# Altium project mainboad-kugreen.PrjPcb
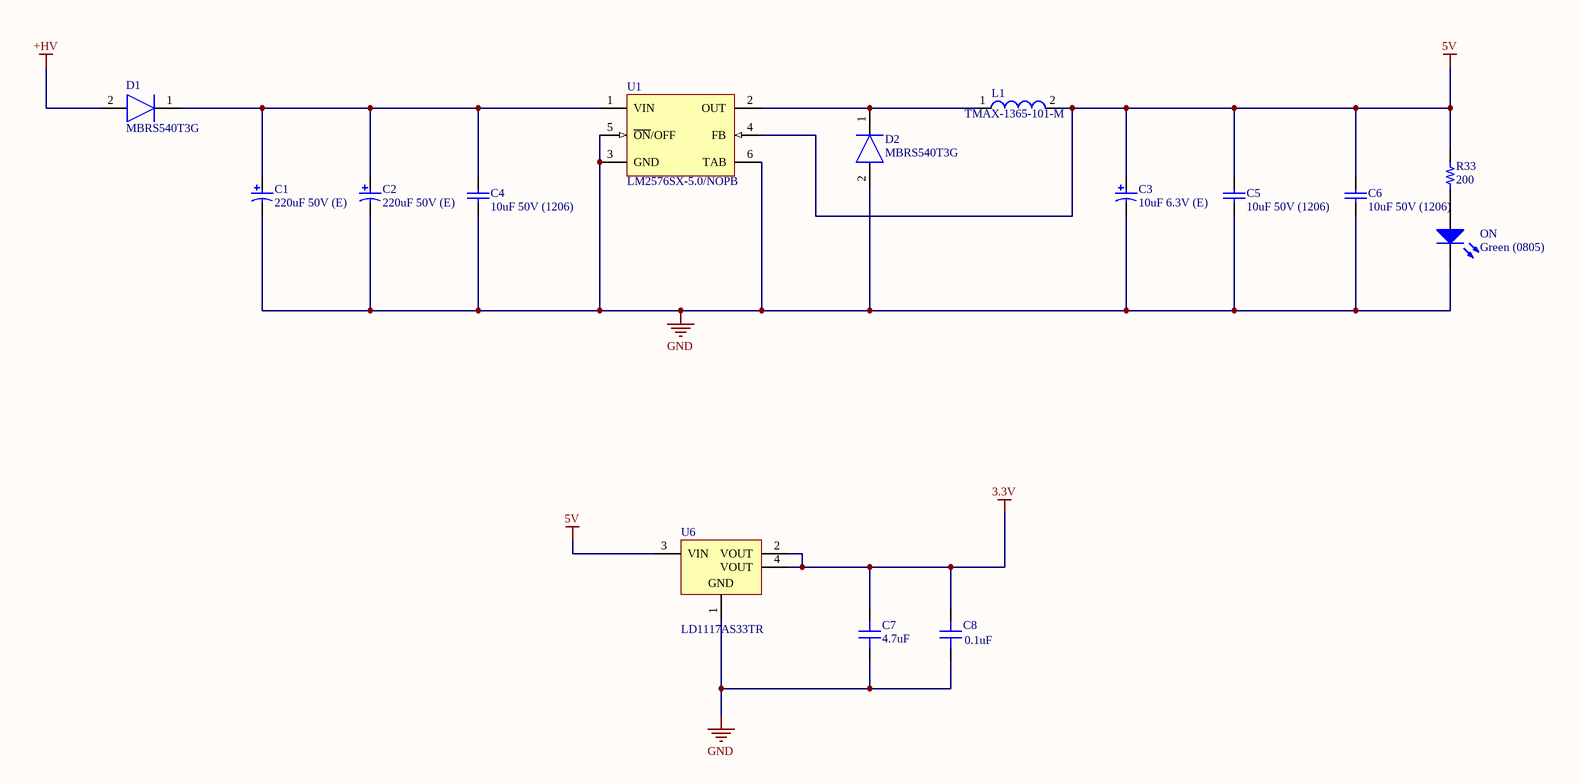
[diagram p0: power-section.SchDoc]
5 sheets, 83 parts. Net scope: global (net labels, ports and power ports of the same name join across sheets).
Board file: mainboard-kugreen.PcbDoc
Sheets:
  power-section.SchDoc
  cpu.SchDoc
  adc-peripheral.SchDoc
  communication.SchDoc
  Controller.SchDoc

## Sheet power-section.SchDoc
size B

### Parts
C1  220uF 50V (E)  [PNSC-EEE-1HA221P_L]
C2  220uF 50V (E)  [PNSC-EEE-1HA221P_L]
C3  10uF 6.3V (E)  [NIC-CAPA2-8X10_V]
C4  10uF 50V (1206)  [CAPC3216X229X50LL20T25]
C5  10uF 50V (1206)  [CAPC3216X229X50LL20T25]
C6  10uF 50V (1206)  [CAPC3216X229X50LL20T25]
C7  4.7uF  [CAP 1206_3216 - 1.8MM]
C8  0.1uF  [CAP 0603_1608]
D1  MBRS540T3G  [DIOM7958X256N]
D2  MBRS540T3G  [DIOM7958X256N]
L1  TMAX-1365-101-M  [WE-HCI-1365]
ON  Green (0805)  [0805_A]
R33  200  [RES 0603_1608]
U1  LM2576SX-5.0/NOPB  [KTT0005B_M]
U6  LD1117AS33TR  [SOT-223_M]

### Nets
3.3V: C7.2 C8.2 U6.2(VOUT) U6.4(VOUT)
5V: C3.1 C5.2 C6.2 L1.2 R33.2 U1.4(FB) U6.3(VIN)
+HV: D1.2(A)
GND: C1.2 C2.2 C3.2 C4.1 C5.1 C6.1 C7.1 C8.1 D2.2(A) ON.1(K) U1.3(GND) U1.5(~{ON}/OFF) U1.6(TAB) U6.1(GND)
NetC1_1: C1.1 C2.1 C4.2 D1.1(K) U1.1(VIN)
NetD2_1: D2.1(K) L1.1 U1.2(OUT)
NetON_2: ON.2(A) R33.1

### Notes on the sheet
- Title
- Size:
- Date:
- B
- Number:
- Time:
- Revision:
- Sheet
- of
- Maptix Co.,Ltd
- 99/193 Atoll Bali Beach
- Khlong Luang Phaeng
- Chacheongsao
- Thailand 24000
- File:

### Library data of the parts
C1 C2 = CMP-2000-06200-1: Aluminum Electrolytic Capacitor, 220 uF, +/- 20%, 50 V, -40 to 85 degC, 2-Pin SMD, RoHS, Tape and Reel; Manufacturer: Panasonic; Lifetime @ Temperature: 2000hours@85°C; AE Capacitor Case: RadialCan-SMD; Capacitance: 220µF; Ripple Current AC: 300mA; SVHC: ToBeAdvised; Product Range: PANASONIC-SSeries; Datasheet Version: 11/2012; Manufacturer URL: http://www.panasonic.com/; Packaging: CutTape; Life Time @ Temperature: 2000hours@85°C; Capacitor Case Style: RadialCan-SMD; Capacitance Tolerance ±: ±20%; Mounting Technology: SurfaceMount; Operating Temperature Max: 85°C; Capacitance Tolerance: ±20%; Package Description: 2-Pin Surface Mount Device, Body 10.3 x 10.3 mm; Voltage Rating: 50V; Package Reference: SMD; Diameter: 10mm; Height: 10.2mm; Operating Temperature Min: -40°C; Datasheet URL: http://datasheet.octopart.com/EEE-1HA221P-Panasonic-datasheet-13265900.pdf
C3 = CMP-0687-00071-1: Aluminum Electrolytic Capacitor, UD Series, Low Impedance, 1000 uF, 6.3 V, + / - 20%, -55 to 105 degC, Chip Type, 8 x 10 mm D x L, Pb-Free, Reel; Manufacturer: Nichicon; PartNumber: UUD0J102MNL1GS; Impedance: 0.17 Ohm; Endurance Time: 5000 h; Rated Capacitance: 1000 uF; Rated Ripple Current (at 100kHz): 450 mA; Packing: Dia382mm Reel; Tolerance Rated Capacitance: -20 to 20%; Diameter: 8 mm; ComponentLink3Description: Package Specification; Mounting Technology: Surface Mount; RoHS: TRUE; ComponentLink3URL: http://products.nichicon.co.jp/en/pdf/XJA043/e-ud.pdf; Length: 10 mm; PackageDescription: 2-Pin Surface Mount Device, Diameter 8 mm, Height 10 mm, Pitch 6.5 mm; DatasheetVersion: 08/2012; ComponentLink2Description: Datasheet; ComponentLink1URL: http://www.nichicon.co.jp/; ComponentLink1Description: Manufacturer URL; Rated Voltage: 6.3 V; ComponentLink2URL: http://products.nichicon.co.jp/en/pdf/XJA043/e-ud.pdf; PackageReference: CAPAE-D8H10
C4-C6 = CMP-2000-05863-1: Chip Capacitor, 10 uF, +/- 10%, 25 V, -55 to 85 degC, 1206 (3216 Metric), RoHS, Tape and Reel; Manufacturer: AVX; Rated Voltage: 25V; Dielectric: X5R; Capacitance: 10µF; Mounting Technology: SurfaceMount; Package Reference: 1206; Tolerance (%): ±10%; Manufacturer URL: http://www.avx.com/; Datasheet URL: http://datasheets.avx.com/cx5r.pdf; Package Description: 2-Pin Surface Mount Device, Body 3.2 x 1.6 mm; Datasheet Version: 05/2016; Case Size/Dimension: 1206
C7 = C1206C335K4PACTU: CAP CERAMIC 16V X5R 1206; Manufacturer: KEMET; Capacitance: 3.3µF; Tolerance: ±10%; Part Number: C1206C335K4PACTU; Value: 4.7uF; Applications: General Purpose; ComponentLink1Description: Datasheet; ComponentLink1URL: https://api.kemet.com/component-edge/download/datasheet/C1206C335K4PACTU.pdf; ComponentLink2Description: DigiKey Link; ComponentLink2URL: http://digikey.com/product-detail/en/kemet/C1206C335K4PACTU/399-1264-1-ND/411539; Device Package: 1206 (3216 Metric); LastUpdated: 1/2/2020 12:03:41 AM; Lifecycle Status: Active; Minimum Order: 1; Mounting Type: Surface Mount, MLCC; Operating Temperature: -55°C ~ 85°C; Package / Case: 1206 (3216 Metric); Packaging: ReReel; PartId: 19546; Part Status: Active; Price: 0.00; Series: SMD Comm X5R; Size / Dimension: 0.126" L x 0.063" W (3.20mm x 1.60mm); Supplier 1: DigiKey; Supplier Part Number 1: 399-1264-1-ND; Temperature Coefficient: X5R; Thickness (Max): 0.071" (1.80mm); Voltage - Rated: 16V
C8 = VJ0603Y332JXACW1BC: CAP CERAMIC 50V X7R 0603; Manufacturer: Vishay Vitramon; Capacitance: 3300pF; Tolerance: ±5%; Part Number: VJ0603Y332JXACW1BC; Value: 0.1uF; Applications: General Purpose; ComponentLink1Description: Datasheet; ComponentLink1URL: https://www.vishay.com/docs/28548/vjw1bcbascomseries.pdf; ComponentLink2Description: DigiKey Link; ComponentLink2URL: http://digikey.com/product-detail/en/vishay-vitramon/VJ0603Y332JXACW1BC/720-VJ0603Y332JXACW1BCCT-ND/11198425; Device Package: 0603 (1608 Metric); LastUpdated: 1/2/2020 12:01:35 AM; Lifecycle Status: Active; Minimum Order: 1; Mounting Type: Surface Mount, MLCC; Operating Temperature: -55°C ~ 125°C; Package / Case: 0603 (1608 Metric); Packaging: Unknown; PartId: 26247; Part Status: Active; Price: 0.00; Series: VJ; Size / Dimension: 0.063" L x 0.031" W (1.60mm x 0.80mm); Supplier 1: DigiKey; Supplier Part Number 1: 720-VJ0603Y332JXACW1BCCT-ND; Temperature Coefficient: X7R; Thickness (Max): 0.034" (0.87mm); Voltage - Rated: 50V
D1 D2 = MBRS540T3G: Diode; Manufacturer_Name: ON Semiconductor; Allied_Number: 70100196; Datasheet Link: http://www.onsemi.com/pub/Collateral/MBRS540T3-D.PDF; Height: 2.56mm; Manufacturer_Part_Number: MBRS540T3G; Mouser Part Number: 863-MBRS540T3G; Mouser Price/Stock: https://www.mouser.com/Search/Refine.aspx?Keyword=863-MBRS540T3G; RS Part Number: 6880512; RS Price/Stock: https://uk.rs-online.com/web/p/products/6880512; Allied Price/Stock: http://www.alliedelec.com/on-semiconductor-mbrs540t3g/70100196/
L1 = CMP-1351-00012-1: SMD Flat Wire High Current Inductor WE-HCI, L=33.0 µH; Manufacturer: Wuerth Elektronik; PartNumber: 7443551331; Inductance: 33.0 ÂµH; ComponentLink1Description: Manufacturer URL; ComponentLink1URL: http://www.we-online.com; PackageDescription: Inductor, 2-Leads, Body 13.2 x 12.8 mm; ComponentLink2URL: http://katalog.we-online.de/kataloge/eisos/media/pdf/7443551331.pdf; ComponentLink2Description: Datasheet; PackageReference: WE-HCI-1365
ON = CMP-1426-00007-1: SMD mono-color Chip LED, WL-SMCW, Green; PartNumber: 150080GS75000; Manufacturer: Wuerth Elektronik; PackageReference: 0805_A; Color: Green; ComponentLink2URL: http://katalog.we-online.com/led/datasheet/150080GS75000.pdf; ComponentLink1URL: http://www.we-online.com; ComponentLink1Description: Manufacturer URL; ComponentLink2Description: Datasheet
R33 = CRCW060329K4FKEA: Resistor; Manufacturer: Vishay Dale; Power (Watts): 0.1W, 1/10W; Resistance: 29.4 kOhms; Temperature Coefficient: ±100ppm/°C; Tolerance: ±1%; Part Number: CRCW060329K4FKEA; Value: 200; ComponentLink1Description: Datasheet; ComponentLink1URL: http://www.vishay.com/docs/20035/dcrcwe3.pdf; ComponentLink2Description: DigiKey Link; ComponentLink2URL: http://digikey.com/product-detail/en/vishay-dale/CRCW060329K4FKEA/541-29.4KHCT-ND/1179975; Composition: Thick Film; Device Package: 0603 (1608 Metric); Features: Automotive AEC-Q200; Height - Seated (Max): 0.020" (0.50mm); LastUpdated: 1/2/2020 12:06:58 AM; Lifecycle Status: Active; Minimum Order: 1; Number of Terminations: 2; Operating Temperature: -55°C ~ 155°C; Package / Case: 0603 (1608 Metric); Packaging: TapeAndReel; PartId: 7975; Part Status: Active; Price: 0.00; Ratings: AEC-Q200; Series: CRCW; Size / Dimension: 0.061" L x 0.033" W (1.55mm x 0.85mm); Supplier 1: DigiKey; Supplier Part Number 1: 541-29.4KHCT-ND; Supplier Device Package: 0603
U1 = CMP-0069-00122-3: SIMPLE SWITCHER® 3A Step-Down Voltage Regulator, 5-pin TO-263, Pb-Free; Manufacturer: Texas Instruments; PackageTopMarking: NSUZXYTTE#*LM2576S*-5.0 P+; PowerWise: N; PackageDescription: TO-263, Molded, .400 x .390 x .180in, 5 Lead, .067in Pitch, Surface Mount; PinCount: 5; PackageReference: KTT0005B; ComponentLink1Description: Datasheet URL; ComponentLink1URL: http://www.ti.com/general/docs/lit/getliterature.tsp?genericPartNumber=LM2576&fileType=pdf; Code_JEDEC: MO-169-AB; CompType: Switcher; RoHS: Y
U6 = CMP-0244-00316-1: 1A, Low Drop Positive Voltage Regulator, 3.3V, 4-Pin SOT-223, Tape and Reel; ComponentLink1Description: Manufacturer URL; DatasheetVersion: 2/12/2011; PackageVersion: 2010; ComponentLink1URL: http://www.st.com; ComponentLink2Description: Datasheet; ComponentLink2URL: http://www.st.com/internet/com/TECHNICAL_RESOURCES/TECHNICAL_LITERATURE/DATASHEET/CD00002116.pdf; PackageDescription: 4-Pin SOT-223 Package, 6.5 x 3.5 mm Body, 2.3 mm Pitch, 7 mm Lead Span; PackageReference: SOT-223

## Sheet cpu.SchDoc
size B
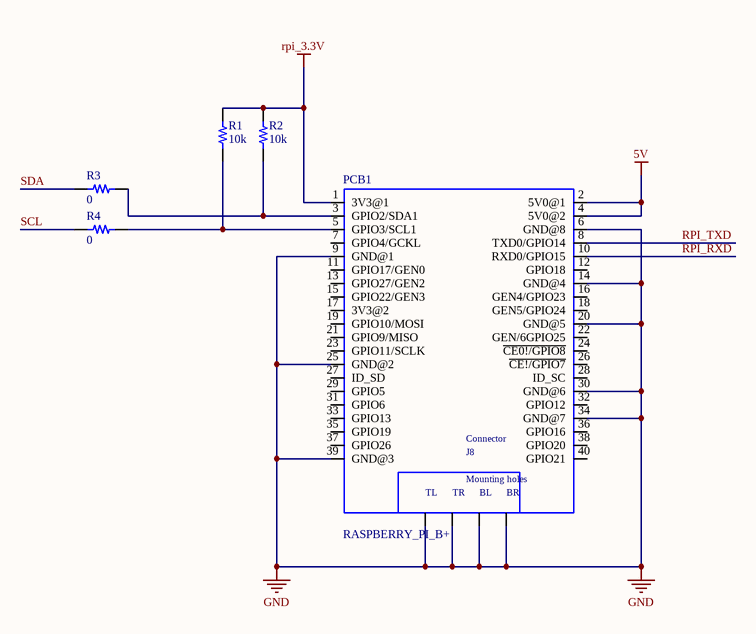
[diagram p1: cpu.SchDoc]

### Parts
PCB1  RASPBERRY_PI_B+  [RASPBERRY_PI_B+]
R1  10k  [RES 0603_1608]
R2  10k  [RES 0603_1608]
R3  0  [RES 0603_1608]
R4  0  [RES 0603_1608]

### Nets
5V: PCB1.2(5V0@1) PCB1.4(5V0@2)
GND: PCB1.6(GND@8) PCB1.9(GND@1) PCB1.14(GND@4) PCB1.20(GND@5) PCB1.25(GND@2) PCB1.30(GND@6) PCB1.34(GND@7) PCB1.39(GND@3) PCB1.PE_BL(BL) PCB1.PE_BR(BR) PCB1.PE_TL(TL) PCB1.PE_TR(TR)
rpi_3.3V: PCB1.1(3V3@1) R1.1 R2.1
RPI_RXD: PCB1.10(RXD0/GPIO15)
RPI_TXD: PCB1.8(TXD0/GPIO14)
SCL: R4.1
SDA: R3.1
NetPCB1_3: PCB1.3(GPIO2/SDA1) R2.2 R3.2
NetPCB1_5: PCB1.5(GPIO3/SCL1) R1.2 R4.2

Not connected (* = marked no-connect by the designer): PCB1 7(GPIO4/GCKL) 11(GPIO17/GEN0) 12(GPIO18) 13(GPIO27/GEN2) 15(GPIO22/GEN3) 16(GEN4/GPIO23) 17(3V3@2) 18(GEN5/GPIO24) 19(GPIO10/MOSI) 21(GPIO9/MISO) 22(GEN/6GPIO25) 23(GPIO11/SCLK) 24(~{CE0!/GPIO8}) 26(~{CE!/GPIO7}) 27(ID_SD) 28(ID_SC) 29(GPIO5) 31(GPIO6) 32(GPIO12) 33(GPIO13) 35(GPIO19) 36(GPIO16) 37(GPIO26) 38(GPIO20) 40(GPIO21)

### Notes on the sheet
- Title
- Size:
- Date:
- B
- Number:
- Time:
- Revision:
- Sheet
- of
- Maptix Co.,Ltd
- 99/193 Atoll Bali Beach
- Khlong Luang Phaeng
- Chacheongsao
- Thailand 24000
- File:
- (in symbol RASPBERRY_PI_B+) Connector; J8; Mounting holes

### Library data of the parts
PCB1 = RASPBERRY_PI_B+: BCM2835 Raspberry Pi Model B+ - ARM11, VideoCore MPU Embedded Evaluation Board; MP: RASPBERRY PI B+; Package: None; Availability: Unavailable; Value: *; SnapEDA_Link: https://www.snapeda.com/parts/RASPBERRY%20PI%20B%2B/Raspberry%20Pi/view-part/559759/?ref=snap; Price: None; MF: Raspberry Pi
R1-R4 = CRCW060329K4FKEA: as R33 on sheet power-section; Part Number: CRCW060329K4FKEA; ComponentLink1Description: Datasheet; ComponentLink1URL: http://www.vishay.com/docs/20035/dcrcwe3.pdf; ComponentLink2Description: DigiKey Link; ComponentLink2URL: http://digikey.com/product-detail/en/vishay-dale/CRCW060329K4FKEA/541-29.4KHCT-ND/1179975; Composition: Thick Film; Device Package: 0603 (1608 Metric); Features: Automotive AEC-Q200; Height - Seated (Max): 0.020" (0.50mm); LastUpdated: 1/2/2020 12:06:58 AM; Lifecycle Status: Active; Minimum Order: 1; Number of Terminations: 2; Operating Temperature: -55°C ~ 155°C; Package / Case: 0603 (1608 Metric); Packaging: TapeAndReel; PartId: 7975; Part Status: Active; Price: 0.00; Ratings: AEC-Q200; Series: CRCW; Size / Dimension: 0.061" L x 0.033" W (1.55mm x 0.85mm); Supplier 1: DigiKey; Supplier Part Number 1: 541-29.4KHCT-ND; Supplier Device Package: 0603
  R1 R2: Value: 10k
  R3 R4: Value: 0

## Sheet adc-peripheral.SchDoc
size B
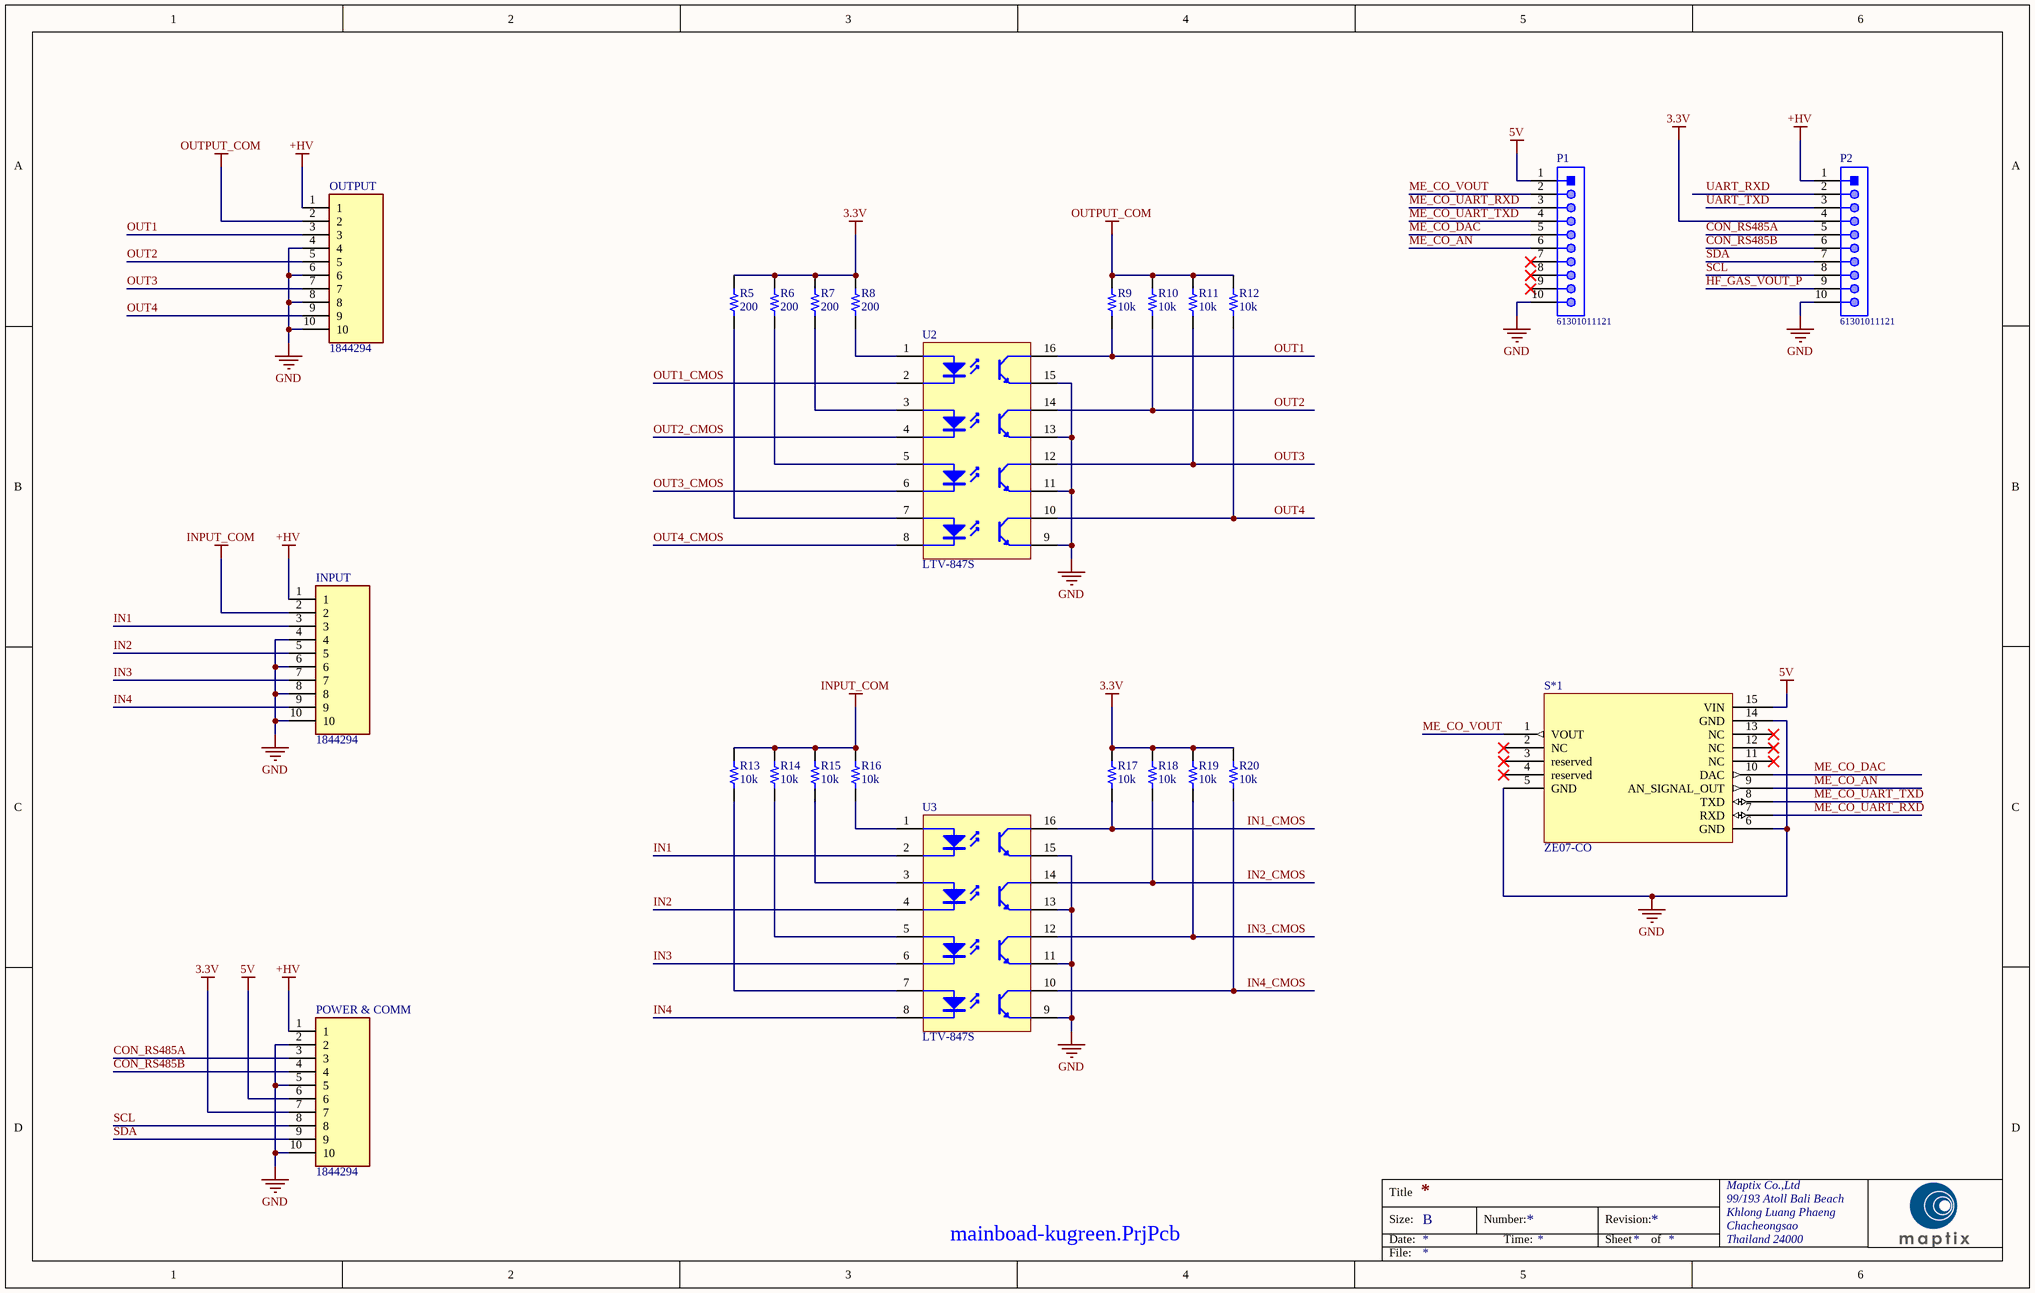
[diagram p2: adc-peripheral.SchDoc]

### Parts
INPUT  1844294  [SHDR10W100P0X350_1X10_3640X920X725P]
OUTPUT  1844294  [SHDR10W100P0X350_1X10_3640X920X725P]
P1  61301011121  [61301011121]
P2  61301011121  [61301011121]
POWER_&_COMM  1844294  [SHDR10W100P0X350_1X10_3640X920X725P]
R5  200  [RES 0603_1608]
R6  200  [RES 0603_1608]
R7  200  [RES 0603_1608]
R8  200  [RES 0603_1608]
R9  10k  [RES 0603_1608]
R10  10k  [RES 0603_1608]
R11  10k  [RES 0603_1608]
R12  10k  [RES 0603_1608]
R13  10k  [RES 0603_1608]
R14  10k  [RES 0603_1608]
R15  10k  [RES 0603_1608]
R16  10k  [RES 0603_1608]
R17  10k  [RES 0603_1608]
R18  10k  [RES 0603_1608]
R19  10k  [RES 0603_1608]
R20  10k  [RES 0603_1608]
S*1  ZE07-CO  [ZE07-CO]
U2  LTV-847S  [LTST-LTV-847S_V]
U3  LTV-847S  [LTST-LTV-847S_V]

### Nets
3.3V: P2.4 POWER_&_COMM.7 R5.2 R6.2 R7.2 R8.2 R17.2 R18.2 R19.2 R20.2
5V: P1.1 POWER_&_COMM.6 S*1.15(VIN)
+HV: INPUT.1 OUTPUT.1 P2.1 POWER_&_COMM.1
GND: INPUT.4 INPUT.6 INPUT.8 INPUT.10 OUTPUT.4 OUTPUT.6 OUTPUT.8 OUTPUT.10 P1.10 P2.10 POWER_&_COMM.2 POWER_&_COMM.5 POWER_&_COMM.10 S*1.5(GND) S*1.6(GND) S*1.14(GND) U2.9(Emitter4) U2.11(Emitter3) U2.13(Emitter2) U2.15(Emitter1) U3.9(Emitter4) U3.11(Emitter3) U3.13(Emitter2) U3.15(Emitter1)
INPUT_COM: INPUT.2 R13.2 R14.2 R15.2 R16.2
OUTPUT_COM: OUTPUT.2 R9.2 R10.2 R11.2 R12.2
CON_RS485A: P2.5 POWER_&_COMM.3
CON_RS485B: P2.6 POWER_&_COMM.4
HF_GAS_VOUT_P: P2.9
IN1: INPUT.3 U3.2(Cathode1)
IN1_CMOS: R17.1 U3.16(Collector1)
IN2: INPUT.5 U3.4(Cathode2)
IN2_CMOS: R18.1 U3.14(Collector2)
IN3: INPUT.7 U3.6(Cathode3)
IN3_CMOS: R19.1 U3.12(Collector3)
IN4: INPUT.9 U3.8(Cathode4)
IN4_CMOS: R20.1 U3.10(Collector4)
ME_CO_AN: P1.6 S*1.9(AN_SIGNAL_OUT)
ME_CO_DAC: P1.5 S*1.10(DAC)
ME_CO_UART_RXD: P1.3 S*1.7(RXD)
ME_CO_UART_TXD: P1.4 S*1.8(TXD)
ME_CO_VOUT: P1.2 S*1.1(VOUT)
OUT1: OUTPUT.3 R9.1 U2.16(Collector1)
OUT1_CMOS: U2.2(Cathode1)
OUT2: OUTPUT.5 R10.1 U2.14(Collector2)
OUT2_CMOS: U2.4(Cathode2)
OUT3: OUTPUT.7 R11.1 U2.12(Collector3)
OUT3_CMOS: U2.6(Cathode3)
OUT4: OUTPUT.9 R12.1 U2.10(Collector4)
OUT4_CMOS: U2.8(Cathode4)
SCL: P2.8 POWER_&_COMM.8
SDA: P2.7 POWER_&_COMM.9
UART_RXD: P2.2
UART_TXD: P2.3
NetR5_1: R5.1 U2.7(Anode4)
NetR6_1: R6.1 U2.5(Anode3)
NetR7_1: R7.1 U2.3(Anode2)
NetR8_1: R8.1 U2.1(Anode1)
NetR13_1: R13.1 U3.7(Anode4)
NetR14_1: R14.1 U3.5(Anode3)
NetR15_1: R15.1 U3.3(Anode2)
NetR16_1: R16.1 U3.1(Anode1)

Not connected (* = marked no-connect by the designer): P1 7* 8* 9*; S*1 2(NC)* 3(reserved)* 4(reserved)* 11(NC)* 12(NC)* 13(NC)*

### Notes on the sheet
- Title
- Size:
- Date:
- B
- Number:
- Time:
- Revision:
- Sheet
- of
- Maptix Co.,Ltd
- 99/193 Atoll Bali Beach
- Khlong Luang Phaeng
- Chacheongsao
- Thailand 24000
- File:

### Library data of the parts
INPUT OUTPUT POWER_&_COMM = 1844294: Connector; Manufacturer_Name: Phoenix Contact; Allied_Number: 70054526; Datasheet Link: http://docs-emea.rs-online.com/webdocs/12bb/0900766b812bb07b.pdf; Height: 7.25mm; Manufacturer_Part_Number: 1844294; Mouser Part Number: 651-1844294; Mouser Price/Stock: https://www.mouser.com/Search/Refine.aspx?Keyword=651-1844294; RS Part Number: 8042267; RS Price/Stock: http://uk.rs-online.com/web/p/products/8042267; Allied Price/Stock: http://www.alliedelec.com/phoenix-contact-1844294/70054526/
P1 P2 = CMP-1502-01082-1: THT Vertical Pin Header WR-PHD, Pitch 2.54 mm, Single Row, 10 pins; Manufacturer: Wurth Elektronik; Contact Resistance: 20mOhm; Rated Current: 3A; Pitch: 2.54mm; Gender: Male; Pin Number: 10; Working Voltage: 250VAC; Withstanding Voltage: 500VAC; Manufacturer URL: http://www.we-online.de; Operating Temperature: -40to105degC; Datasheet URL: https://katalog.we-online.de/em/datasheet/6130xx11121.pdf; Row Number: Single; Orientation: Vertical; Part Number: 61301011121; Packaging: Bag; Package Reference: 61301011121; Mounting Technology: THT; Publisher: WurthElektronik
R5-R20 = CRCW060329K4FKEA: as R33 on sheet power-section; Part Number: CRCW060329K4FKEA; ComponentLink1Description: Datasheet; ComponentLink1URL: http://www.vishay.com/docs/20035/dcrcwe3.pdf; ComponentLink2Description: DigiKey Link; ComponentLink2URL: http://digikey.com/product-detail/en/vishay-dale/CRCW060329K4FKEA/541-29.4KHCT-ND/1179975; Composition: Thick Film; Device Package: 0603 (1608 Metric); Features: Automotive AEC-Q200; Height - Seated (Max): 0.020" (0.50mm); LastUpdated: 1/2/2020 12:06:58 AM; Lifecycle Status: Active; Minimum Order: 1; Number of Terminations: 2; Operating Temperature: -55°C ~ 155°C; Package / Case: 0603 (1608 Metric); Packaging: TapeAndReel; PartId: 7975; Part Status: Active; Price: 0.00; Ratings: AEC-Q200; Series: CRCW; Size / Dimension: 0.061" L x 0.033" W (1.55mm x 0.85mm); Supplier 1: DigiKey; Supplier Part Number 1: 541-29.4KHCT-ND; Supplier Device Package: 0603
  R5-R8: Value: 200
  R9-R20: Value: 10k
U2 U3 = CMP-2000-06633-1: Photocoupler, 50 mA, -30 to 110 degC, 16-Pin SMD, RoHS, Tube; Manufacturer: Lite-On; Output Voltage-Max: 35V; CTR-Min: 50%; No of Channels: 4; Isolation Voltage-Max: 5000V; Package Reference: LTV-847S; Operating Temp-Max: 100°C; Datasheet Version: Rev. K, 03/2010; Datasheet URL: http://optoelectronics.liteon.com/upload/download/DS-70-96-0016/S_110_LTV-817%20%20827%20%20847%20(%20M,%20S,%20S-TA,%20S-TA1,%20S-TP%20)%20Series.pdf; Manufacturer URL: http://www.us.liteon.com/; Package Description: 16-Pin Surface Mount Device, Body 19.84 x 6.5 mm, Pitch 2.54 mm; Mounting Technology: SurfaceMount

## Sheet communication.SchDoc: Communication-interface
size B
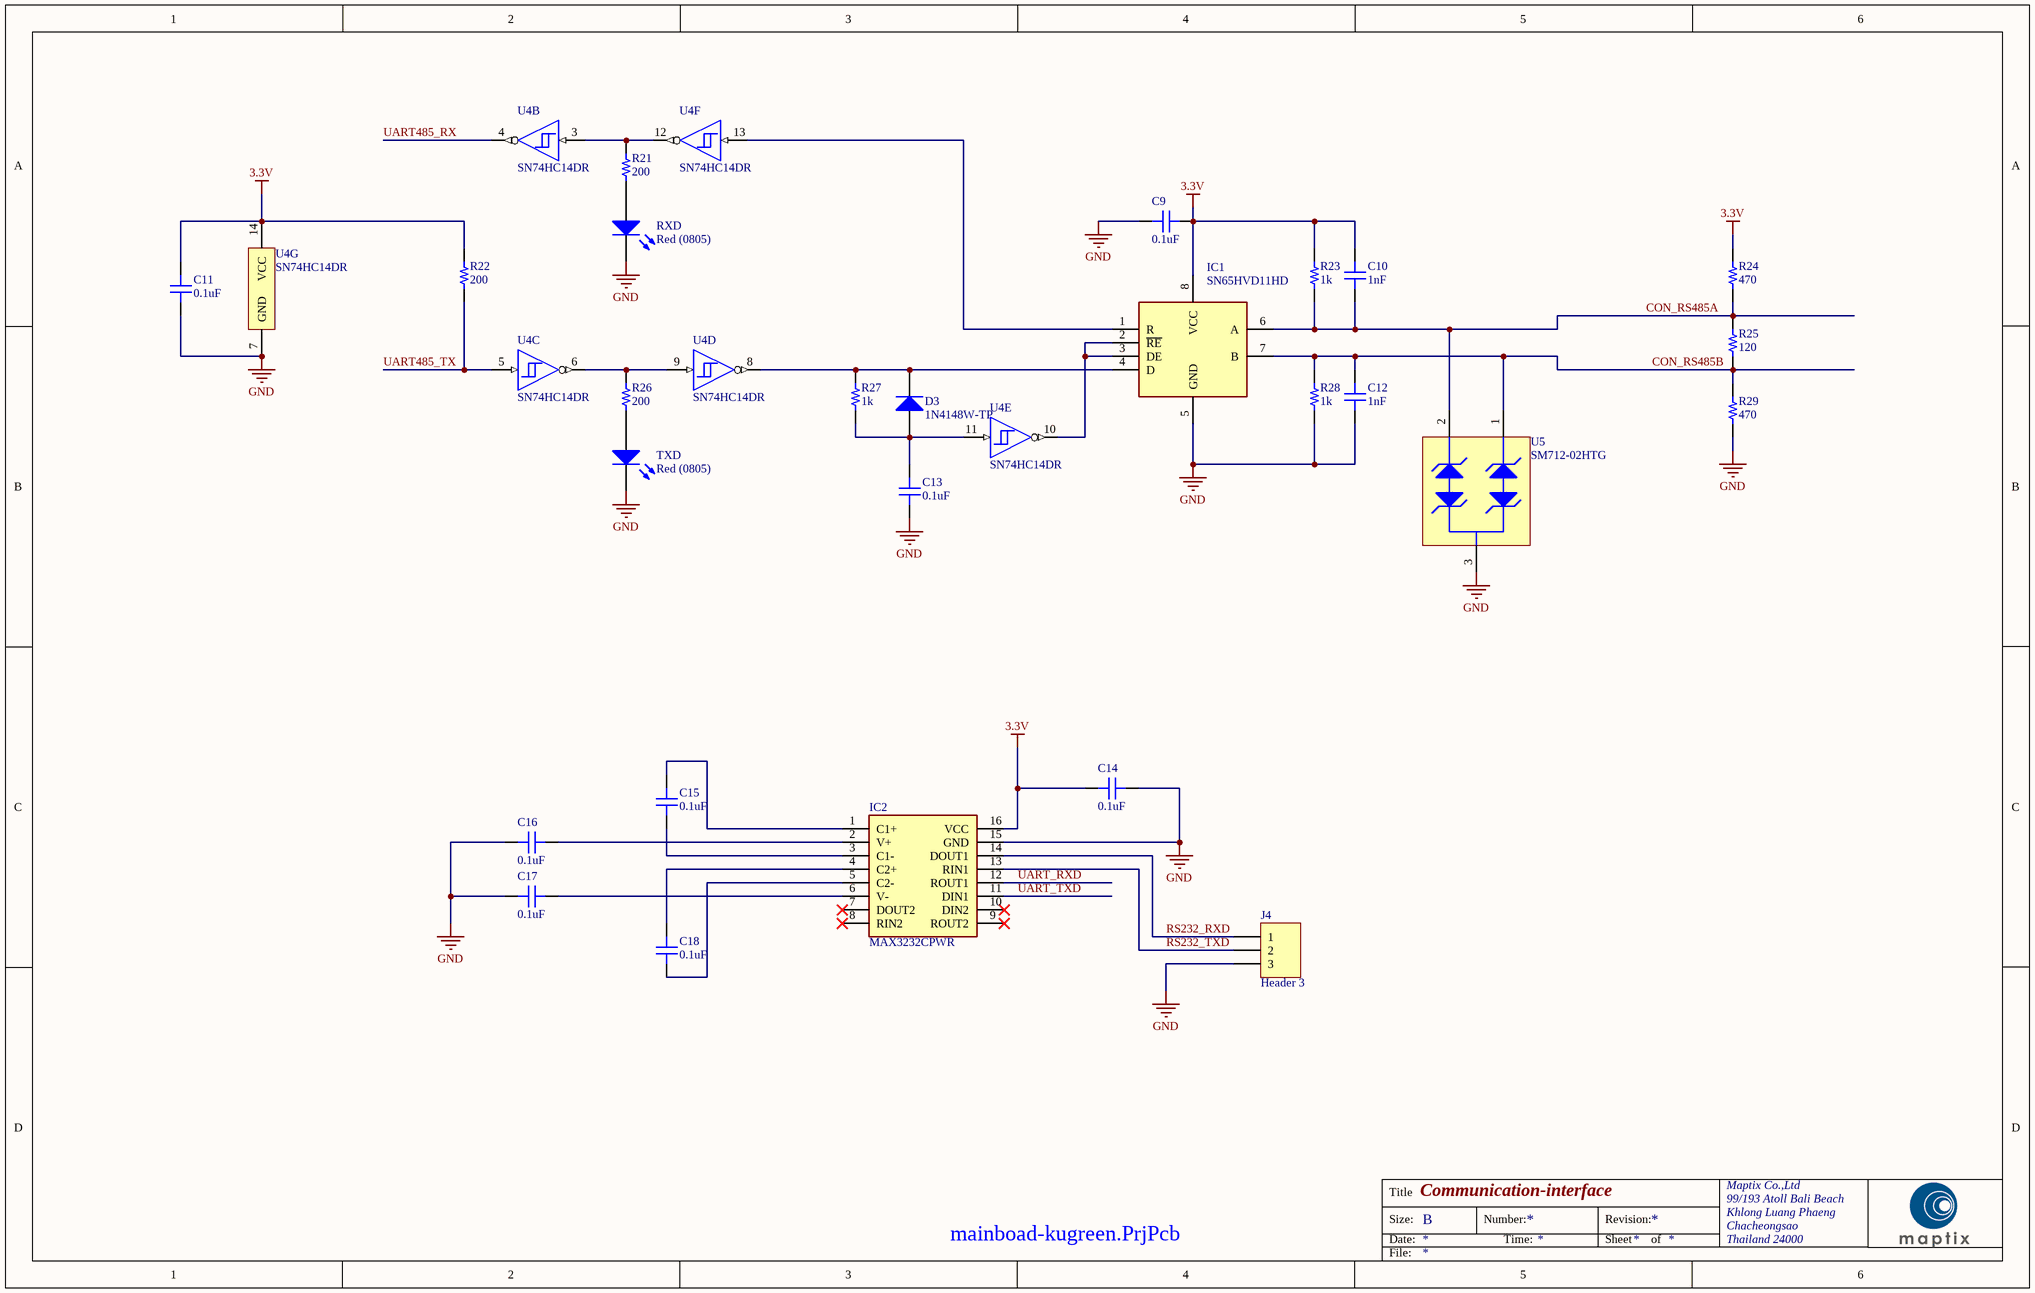
[diagram p3: communication.SchDoc]

### Parts
C9  0.1uF  [CAP 0603_1608]
C10  1nF  [CAP 0603_1608]
C11  0.1uF  [CAP 0603_1608]
C12  1nF  [CAP 0603_1608]
C13  0.1uF  [CAP 0603_1608]
C14  0.1uF  [CAP 0603_1608]
C15  0.1uF  [CAP 0603_1608]
C16  0.1uF  [CAP 0603_1608]
C17  0.1uF  [CAP 0603_1608]
C18  0.1uF  [CAP 0603_1608]
D3  1N4148W-TP  [MCC-SOD123_V]
IC1  SN65HVD11HD  [SOIC127P600X175-8N]
IC2  MAX3232CPWR  [SOP65P640X120-16N]
J4  Header 3  [HDR1X3]
R21  200  [RES 0603_1608]
R22  200  [RES 0603_1608]
R23  1k  [RES 0603_1608]
R24  470  [RES 0603_1608]
R25  120  [RES 0603_1608]
R26  200  [RES 0603_1608]
R27  1k  [RES 0603_1608]
R28  1k  [RES 0603_1608]
R29  470  [RES 0603_1608]
RXD  Red (0805)  [0805_A]
TXD  Red (0805)  [0805_A]
U4  SN74HC14DR  [D0014A_N]  (parts B,C,D,E,F,G of 7)
U5  SM712-02HTG  [LFUS-SOT23-3_V]

### Nets
3.3V: C9.2 C10.2 C11.2 C14.1 IC1.8(VCC) IC2.16(VCC) R22.2 R23.2 R24.2 U4.14(VCC)
GND: C9.1 C11.1 C12.1 C13.1 C14.2 C16.1 C17.1 IC1.5(GND) IC2.15(GND) J4.3 R28.1 R29.1 RXD.1(K) TXD.1(K) U4.7(GND) U5.3
CON_RS485A: C10.1 IC1.6(A) R23.1 R24.1 R25.2 U5.2
CON_RS485B: C12.2 IC1.7(B) R25.1 R28.2 R29.2 U5.1
RS232_RXD: IC2.14(DOUT1) J4.1
RS232_TXD: IC2.13(RIN1) J4.2
UART485_RX: U4.4(~{2Y})
UART485_TX: R22.1 U4.5(3A)
UART_RXD: IC2.12(ROUT1)
UART_TXD: IC2.11(DIN1)
NetC13_2: C13.2 D3.1(A) R27.1 U4.11(5A)
NetC15_1: C15.1 IC2.1(C1+)
NetC15_2: C15.2 IC2.3(C1-)
NetC16_2: C16.2 IC2.2(V+)
NetC17_2: C17.2 IC2.6(V-)
NetC18_1: C18.1 IC2.4(C2+)
NetC18_2: C18.2 IC2.5(C2-)
NetD3_2: D3.2(K) IC1.4(D) R27.2 U4.8(~{4Y})
NetIC1_1: IC1.1(R) U4.13(6A)
NetIC1_2: IC1.2(~{RE}) IC1.3(DE) U4.10(~{5Y})
NetR21_1: R21.1 RXD.2(A)
NetR21_2: R21.2 U4.3(2A) U4.12(~{6Y})
NetR26_1: R26.1 TXD.2(A)
NetR26_2: R26.2 U4.6(~{3Y}) U4.9(4A)

Not connected (* = marked no-connect by the designer): IC2 7(DOUT2)* 8(RIN2)* 9(ROUT2)* 10(DIN2)*

### Notes on the sheet
- Title
- Size:
- Date:
- B
- Number:
- Time:
- Revision:
- Sheet
- of
- Maptix Co.,Ltd
- 99/193 Atoll Bali Beach
- Khlong Luang Phaeng
- Chacheongsao
- Thailand 24000
- File:

### Library data of the parts
C9-C18 = VJ0603Y332JXACW1BC: as C8 on sheet power-section; Part Number: VJ0603Y332JXACW1BC; Applications: General Purpose; ComponentLink1Description: Datasheet; ComponentLink1URL: https://www.vishay.com/docs/28548/vjw1bcbascomseries.pdf; ComponentLink2Description: DigiKey Link; ComponentLink2URL: http://digikey.com/product-detail/en/vishay-vitramon/VJ0603Y332JXACW1BC/720-VJ0603Y332JXACW1BCCT-ND/11198425; Device Package: 0603 (1608 Metric); LastUpdated: 1/2/2020 12:01:35 AM; Lifecycle Status: Active; Minimum Order: 1; Mounting Type: Surface Mount, MLCC; Operating Temperature: -55°C ~ 125°C; Package / Case: 0603 (1608 Metric); Packaging: Unknown; PartId: 26247; Part Status: Active; Price: 0.00; Series: VJ; Size / Dimension: 0.063" L x 0.031" W (1.60mm x 0.80mm); Supplier 1: DigiKey; Supplier Part Number 1: 720-VJ0603Y332JXACW1BCCT-ND; Temperature Coefficient: X7R; Thickness (Max): 0.034" (0.87mm); Voltage - Rated: 50V
  C9 C11 C13-C18: Value: 0.1uF
  C10 C12: Value: 1nF
D3 = CMP-2000-04993-1: High Speed Switching Diode, 400 mW, 150 mA, -65 to 150 degC, 2-Pin SOD123, RoHS, Tape and Reel; Manufacturer: Micro Commercial Components; Reverse Recovery Time-Max: 4ns; Average Forward Current-Max: 0.15A; Peak Current-Max: 2A; Power Dissipation: 400mW; Reverse Voltage-Max [Vrrm]: 100V; Datasheet URL: https://datasheet.ciiva.com/16836/1n4148wsod123-16836277.pdf; Package Reference: SOD123; Package URL: http://www.mccsemi.com/up_pdf/1N4448W(SOD-123).pdf; Package Description: 2-Pin Small Outline Diode, Body 2.7 x 1.6 mm, Height 1.35 mm; Manufacturer URL: http://www.mccsemi.com/; Datasheet Version: Rev. C, 07/2014
IC1 = SN65HVD11HD: Integrated Circuit; Manufacturer_Name: Texas Instruments; Datasheet Link: http://www.ti.com/lit/gpn/sn65hvd11-ht; Height: 1.75mm; Manufacturer_Part_Number: SN65HVD11HD; Mouser Part Number: 595-SN65HVD11HD; Mouser Price/Stock: https://www.mouser.com/Search/Refine.aspx?Keyword=595-SN65HVD11HD
IC2 = MAX3232CPWR: Integrated Circuit; Manufacturer_Name: Texas Instruments; Datasheet Link: http://www.ti.com/lit/gpn/max3232; Height: 1.2mm; Manufacturer_Part_Number: MAX3232CPWR; Mouser Part Number: 595-MAX3232CPWR; Mouser Price/Stock: https://www.mouser.com/Search/Refine.aspx?Keyword=595-MAX3232CPWR
J4 = Header 3: Header, 3-Pin; LatestRevisionDate: 17-Jul-2002; LatestRevisionNote: Re-released for DXP Platform.; Publisher: Altium Limited
R21-R29 = CRCW060329K4FKEA: as R33 on sheet power-section; Part Number: CRCW060329K4FKEA; ComponentLink1Description: Datasheet; ComponentLink1URL: http://www.vishay.com/docs/20035/dcrcwe3.pdf; ComponentLink2Description: DigiKey Link; ComponentLink2URL: http://digikey.com/product-detail/en/vishay-dale/CRCW060329K4FKEA/541-29.4KHCT-ND/1179975; Composition: Thick Film; Device Package: 0603 (1608 Metric); Features: Automotive AEC-Q200; Height - Seated (Max): 0.020" (0.50mm); LastUpdated: 1/2/2020 12:06:58 AM; Lifecycle Status: Active; Minimum Order: 1; Number of Terminations: 2; Operating Temperature: -55°C ~ 155°C; Package / Case: 0603 (1608 Metric); Packaging: TapeAndReel; PartId: 7975; Part Status: Active; Price: 0.00; Ratings: AEC-Q200; Series: CRCW; Size / Dimension: 0.061" L x 0.033" W (1.55mm x 0.85mm); Supplier 1: DigiKey; Supplier Part Number 1: 541-29.4KHCT-ND; Supplier Device Package: 0603
  R21 R22 R26: Value: 200
  R23 R27 R28: Value: 1k
  R24 R29: Value: 470
  R25: Value: 120
RXD TXD = CMP-1426-00007-1: as ON on sheet power-section; PackageReference: 0805_A; Color: Green; ComponentLink2URL: http://katalog.we-online.com/led/datasheet/150080GS75000.pdf; ComponentLink1URL: http://www.we-online.com; ComponentLink1Description: Manufacturer URL; ComponentLink2Description: Datasheet
U4 = CMP-1615-00273-3: Hex Schmitt-Trigger Inverters, D0014A, LARGE T&R; Manufacturer: Texas Instruments; tpd @ Nom Voltage(Max)(ns): 31; Schmitt Trigger: Yes; Output Drive (IOL/IOH)(Max)(mA): -4/4; F @ Nom Voltage(Max)(Mhz): 20; Technology Family: HC; Output Type: CMOS; VCC(Min)(V): 2; ICC @ Nom Voltage(Max)(mA): 0.02; Bits(#): 6; Rating: Catalog; Voltage(Nom)(V): 5; PackageReference: D0014A; Code_JEDEC: MS-012; Input Type: CMOS; Operating Temperature Range(C): -40 to 85; Generic Part Number: SN74HC14; VCC(Max)(V): 6; DatasheetVersion: SCLS085G
U5 = CMP-2000-07561-1: TVS Diode Array, 600 W, 12 V, -40 to 125 degC, 3-Pin SOT23, RoHS, Tape and Reel; Manufacturer: Littelfuse; Case\/Package: TO-236-3; Number of Bidirectional Channels: 2; Min Breakdown Voltage: 13.3V; Clamping Voltage: 31V; Direction: Bidirectional; Element Configuration: Dual; Reverse Standoff Voltage: 12V; Max Surge Current: 19A; Leakage Current: 20uA; Capacitance: 75pF; Max Power Dissipation: 600W; Power Line Protection: No; Depth: 1.4mm; Packaging: TapeandReel; Datasheet URL: http://www.littelfuse.com/~/media/electronics/datasheets/tvs_diode_arrays/littelfuse_tvs_diode_array_sm712_datasheet.pdf.pdf; Package Description: 3-Pin Surface Mount Device, Body 2.92 x 1.3 mm, Pitch 0.95 mm; Package Reference: SOT23-3; Lead Free: LeadFree; Datasheet Version: 12/2016; Termination: SMD/SMT; Mounting Technology: SurfaceMount; Package Quantity: 3000; Radiation Hardening: No; Min Operating Temperature: -40degC; Breakdown Voltage: 13.3V; Working Voltage: 12V; RoHSCompliant: True; Number of Channels: 2; Number of Pins: 3; Max Operating Temperature: 125degC; Manufacturer URL: http://www.littelfuse.com/; Polarity: Bidirectional; Mount: SurfaceMount; Peak Pulse Current: 19A; Peak Pulse Power: 600W; Length: 3.04mm

## Sheet Controller.SchDoc: Controller-Section
size B
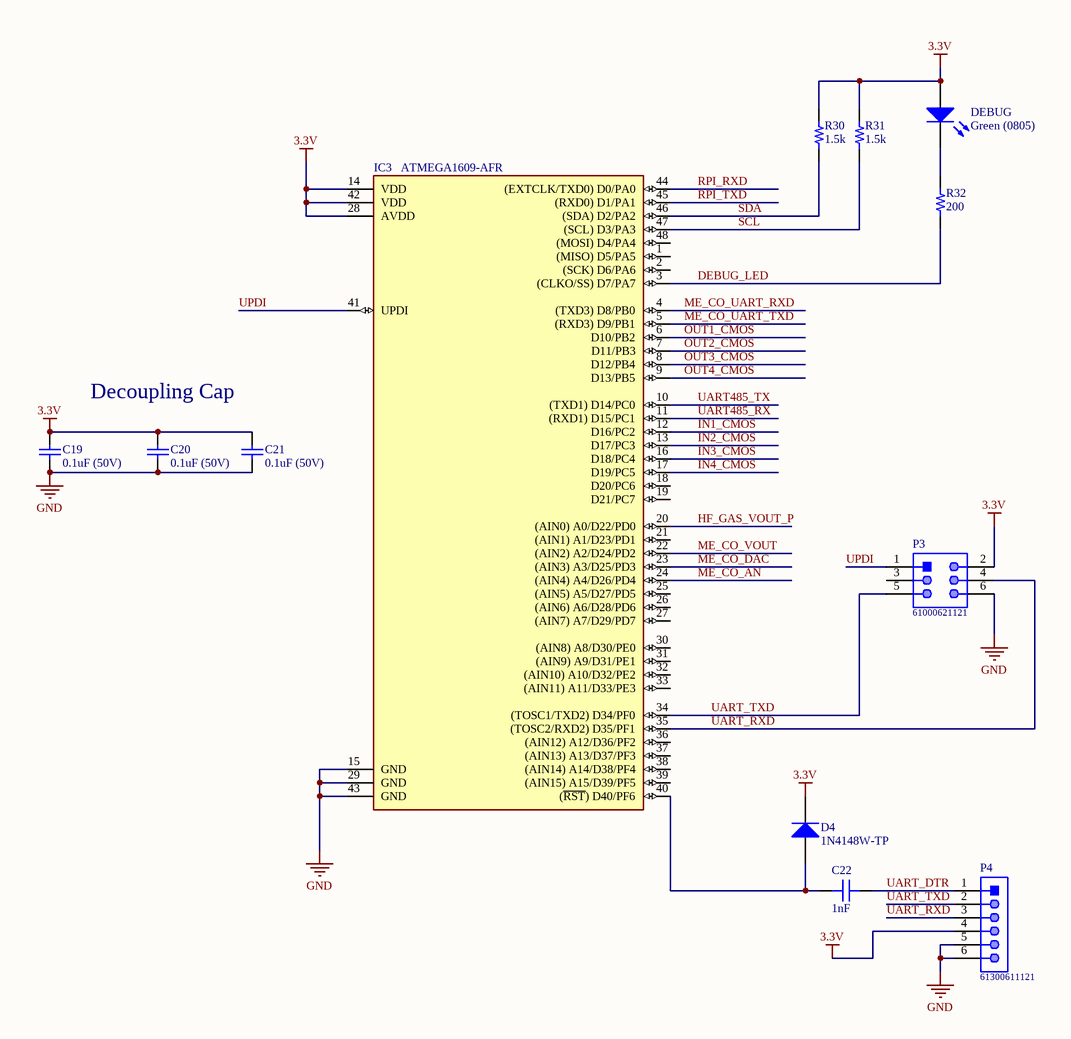
[diagram p4: Controller.SchDoc]

### Parts
C19  0.1uF (50V)  [CAPC1608X95X40NL15T15]
C20  0.1uF (50V)  [CAPC1608X95X40NL15T15]
C21  0.1uF (50V)  [CAPC1608X95X40NL15T15]
C22  1nF  [CAP 0603_1608]
D4  1N4148W-TP  [MCC-SOD123_V]
DEBUG  Green (0805)  [0805_A]
IC3  ATMEGA1609-AFR  [QFP50P900X900X120-48N]
P3  61000621121  [61000621121]
P4  61300611121  [61300611121]
R30  1.5k  [RES 0603_1608]
R31  1.5k  [RES 0603_1608]
R32  200  [RES 0603_1608]

### Nets
3.3V: C19.2 C20.2 C21.2 D4.2(K) DEBUG.2(A) IC3.14(VDD) IC3.28(AVDD) IC3.42(VDD) P3.2 P4.4 R30.1 R31.1
GND: C19.1 C20.1 C21.1 IC3.15(GND) IC3.29(GND) IC3.43(GND) P3.6 P4.5 P4.6
DEBUG_LED: IC3.3((CLKO/SS)_D7/PA7) R32.1
HF_GAS_VOUT_P: IC3.20((AIN0)_A0/D22/PD0)
IN1_CMOS: IC3.12(D16/PC2)
IN2_CMOS: IC3.13(D17/PC3)
IN3_CMOS: IC3.16(D18/PC4)
IN4_CMOS: IC3.17(D19/PC5)
ME_CO_AN: IC3.24((AIN4)_A4/D26/PD4)
ME_CO_DAC: IC3.23((AIN3)_A3/D25/PD3)
ME_CO_UART_RXD: IC3.4((TXD3)_D8/PB0)
ME_CO_UART_TXD: IC3.5((RXD3)_D9/PB1)
ME_CO_VOUT: IC3.22((AIN2)_A2/D24/PD2)
OUT1_CMOS: IC3.6(D10/PB2)
OUT2_CMOS: IC3.7(D11/PB3)
OUT3_CMOS: IC3.8(D12/PB4)
OUT4_CMOS: IC3.9(D13/PB5)
RPI_RXD: IC3.44((EXTCLK/TXD0)_D0/PA0)
RPI_TXD: IC3.45((RXD0)_D1/PA1)
SCL: IC3.47((SCL)_D3/PA3) R31.2
SDA: IC3.46((SDA)_D2/PA2) R30.2
UART485_RX: IC3.11((RXD1)_D15/PC1)
UART485_TX: IC3.10((TXD1)_D14/PC0)
UART_DTR: C22.1 P4.1
UART_RXD: IC3.35((TOSC2/RXD2)_D35/PF1) P3.4 P4.3
UART_TXD: IC3.34((TOSC1/TXD2)_D34/PF0) P3.5 P4.2
UPDI: IC3.41(UPDI) P3.1
NetC22_2: C22.2 D4.1(A) IC3.40((~{RST})_D40/PF6)
NetDEBUG_1: DEBUG.1(K) R32.2

Not connected (* = marked no-connect by the designer): IC3 1((MISO)_D5/PA5) 2((SCK)_D6/PA6) 18(D20/PC6) 19(D21/PC7) 21((AIN1)_A1/D23/PD1) 25((AIN5)_A5/D27/PD5) 26((AIN6)_A6/D28/PD6) 27((AIN7)_A7/D29/PD7) 30((AIN8)_A8/D30/PE0) 31((AIN9)_A9/D31/PE1) 32((AIN10)_A10/D32/PE2) 33((AIN11)_A11/D33/PE3) 36((AIN12)_A12/D36/PF2) 37((AIN13)_A13/D37/PF3) 38((AIN14)_A14/D38/PF4) 39((AIN15)_A15/D39/PF5) 48((MOSI)_D4/PA4); P3 3

### Notes on the sheet
- Decoupling Cap
- Title
- Size:
- Date:
- B
- Number:
- Time:
- Revision:
- Sheet
- of
- Maptix Co.,Ltd
- 99/193 Atoll Bali Beach
- Khlong Luang Phaeng
- Chacheongsao
- Thailand 24000
- File:

### Library data of the parts
C19-C21 = CMP-2006-00072-1: Part Number: VJ0603Y332JXACW1BC; Manufacturer: Vitramon
C22 = VJ0603Y332JXACW1BC: as C8 on sheet power-section; Part Number: VJ0603Y332JXACW1BC; Value: 1nF; Applications: General Purpose; ComponentLink1Description: Datasheet; ComponentLink1URL: https://www.vishay.com/docs/28548/vjw1bcbascomseries.pdf; ComponentLink2Description: DigiKey Link; ComponentLink2URL: http://digikey.com/product-detail/en/vishay-vitramon/VJ0603Y332JXACW1BC/720-VJ0603Y332JXACW1BCCT-ND/11198425; Device Package: 0603 (1608 Metric); LastUpdated: 1/2/2020 12:01:35 AM; Lifecycle Status: Active; Minimum Order: 1; Mounting Type: Surface Mount, MLCC; Operating Temperature: -55°C ~ 125°C; Package / Case: 0603 (1608 Metric); Packaging: Unknown; PartId: 26247; Part Status: Active; Price: 0.00; Series: VJ; Size / Dimension: 0.063" L x 0.031" W (1.60mm x 0.80mm); Supplier 1: DigiKey; Supplier Part Number 1: 720-VJ0603Y332JXACW1BCCT-ND; Temperature Coefficient: X7R; Thickness (Max): 0.034" (0.87mm); Voltage - Rated: 50V
D4 = CMP-2000-04993-1: as D3 on sheet communication; Datasheet URL: https://datasheet.ciiva.com/16836/1n4148wsod123-16836277.pdf; Package Reference: SOD123; Package URL: http://www.mccsemi.com/up_pdf/1N4448W(SOD-123).pdf; Package Description: 2-Pin Small Outline Diode, Body 2.7 x 1.6 mm, Height 1.35 mm; Manufacturer URL: http://www.mccsemi.com/; Datasheet Version: Rev. C, 07/2014
DEBUG = CMP-1426-00007-1: as ON on sheet power-section; PackageReference: 0805_A; Color: Green; ComponentLink2URL: http://katalog.we-online.com/led/datasheet/150080GS75000.pdf; ComponentLink1URL: http://www.we-online.com; ComponentLink1Description: Manufacturer URL; ComponentLink2Description: Datasheet
IC3 = ATMEGA1609-AFR: Integrated Circuit; Manufacturer_Name: Microchip; Datasheet Link: https://componentsearchengine.com/Datasheets/1/ATMEGA1609-AFR.pdf; Height: 1.2mm; Manufacturer_Part_Number: ATMEGA1609-AFR; Mouser Part Number: 579-ATMEGA1609-AFR; Mouser Price/Stock: https://www.mouser.com/Search/Refine.aspx?Keyword=579-ATMEGA1609-AFR
P3 = CMP-1502-01024-1: SMT Vertical Pin Header WR-PHD, Pitch 2.54 mm, Dual Row, 6 pins; Manufacturer: Wurth Elektronik; Withstanding Voltage: 500VAC; Contact Resistance: 20mOhm; Working Voltage: 250VAC; Gender: Male; Rated Current: 3A; Pin Number: 6; Pitch: 2.54mm; Part Number: 61000621121; Operating Temperature: -40to125degC; Mounting Technology: SMT; Packaging: Tube; Datasheet URL: https://katalog.we-online.de/em/datasheet/6100xx21121.pdf; Package Reference: 61000621121; Publisher: WurthElektronik; Row Number: Dual; Orientation: Vertical; Manufacturer URL: http://www.we-online.de
P4 = CMP-1502-01070-1: THT Vertical Pin Header WR-PHD, Pitch 2.54 mm, Single Row, 6 pins; Manufacturer: Wurth Elektronik; Gender: Male; Pin Number: 6; Pitch: 2.54mm; Working Voltage: 250VAC; Rated Current: 3A; Withstanding Voltage: 500VAC; Contact Resistance: 20mOhm; Operating Temperature: -40to105degC; Packaging: Bag; Datasheet URL: https://katalog.we-online.de/em/datasheet/6130xx11121.pdf; Package Reference: 61300611121; Mounting Technology: THT; Publisher: WurthElektronik; Part Number: 61300611121; Manufacturer URL: http://www.we-online.de; Row Number: Single; Orientation: Vertical
R30-R32 = CRCW060329K4FKEA: as R33 on sheet power-section; Part Number: CRCW060329K4FKEA; ComponentLink1Description: Datasheet; ComponentLink1URL: http://www.vishay.com/docs/20035/dcrcwe3.pdf; ComponentLink2Description: DigiKey Link; ComponentLink2URL: http://digikey.com/product-detail/en/vishay-dale/CRCW060329K4FKEA/541-29.4KHCT-ND/1179975; Composition: Thick Film; Device Package: 0603 (1608 Metric); Features: Automotive AEC-Q200; Height - Seated (Max): 0.020" (0.50mm); LastUpdated: 1/2/2020 12:06:58 AM; Lifecycle Status: Active; Minimum Order: 1; Number of Terminations: 2; Operating Temperature: -55°C ~ 155°C; Package / Case: 0603 (1608 Metric); Packaging: TapeAndReel; PartId: 7975; Part Status: Active; Price: 0.00; Ratings: AEC-Q200; Series: CRCW; Size / Dimension: 0.061" L x 0.033" W (1.55mm x 0.85mm); Supplier 1: DigiKey; Supplier Part Number 1: 541-29.4KHCT-ND; Supplier Device Package: 0603
  R30 R31: Value: 1.5k
  R32: Value: 200

## Nets that join several sheets
3.3V: power-section (C7.2 C8.2 U6.2 U6.4), adc-peripheral (10 pins), communication (10 pins), Controller (12 pins)
5V: power-section (7 pins), cpu (PCB1.2 PCB1.4), adc-peripheral (P1.1 POWER_&_COMM.6 S*1.15)
+HV: power-section (D1.2), adc-peripheral (INPUT.1 OUTPUT.1 P2.1 POWER_&_COMM.1)
GND: power-section (14 pins), cpu (12 pins), adc-peripheral (24 pins), communication (16 pins), Controller (9 pins)
CON_RS485A: adc-peripheral (P2.5 POWER_&_COMM.3), communication (6 pins)
CON_RS485B: adc-peripheral (P2.6 POWER_&_COMM.4), communication (6 pins)
HF_GAS_VOUT_P: adc-peripheral (P2.9), Controller (IC3.20)
IN1_CMOS: adc-peripheral (R17.1 U3.16), Controller (IC3.12)
IN2_CMOS: adc-peripheral (R18.1 U3.14), Controller (IC3.13)
IN3_CMOS: adc-peripheral (R19.1 U3.12), Controller (IC3.16)
IN4_CMOS: adc-peripheral (R20.1 U3.10), Controller (IC3.17)
ME_CO_AN: adc-peripheral (P1.6 S*1.9), Controller (IC3.24)
ME_CO_DAC: adc-peripheral (P1.5 S*1.10), Controller (IC3.23)
ME_CO_UART_RXD: adc-peripheral (P1.3 S*1.7), Controller (IC3.4)
ME_CO_UART_TXD: adc-peripheral (P1.4 S*1.8), Controller (IC3.5)
ME_CO_VOUT: adc-peripheral (P1.2 S*1.1), Controller (IC3.22)
OUT1_CMOS: adc-peripheral (U2.2), Controller (IC3.6)
OUT2_CMOS: adc-peripheral (U2.4), Controller (IC3.7)
OUT3_CMOS: adc-peripheral (U2.6), Controller (IC3.8)
OUT4_CMOS: adc-peripheral (U2.8), Controller (IC3.9)
RPI_RXD: cpu (PCB1.10), Controller (IC3.44)
RPI_TXD: cpu (PCB1.8), Controller (IC3.45)
SCL: cpu (R4.1), adc-peripheral (P2.8 POWER_&_COMM.8), Controller (IC3.47 R31.2)
SDA: cpu (R3.1), adc-peripheral (P2.7 POWER_&_COMM.9), Controller (IC3.46 R30.2)
UART485_RX: communication (U4.4), Controller (IC3.11)
UART485_TX: communication (R22.1 U4.5), Controller (IC3.10)
UART_RXD: adc-peripheral (P2.2), communication (IC2.12), Controller (IC3.35 P3.4 P4.3)
UART_TXD: adc-peripheral (P2.3), communication (IC2.11), Controller (IC3.34 P3.5 P4.2)